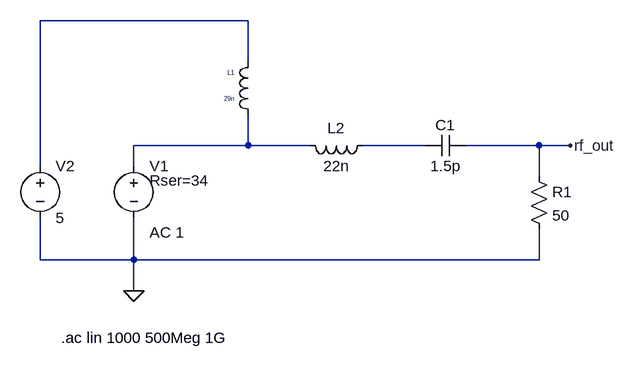
[diagram p0: schematic max41462_matching.asc]
max41462_matching.asc, the LTspice schematic file:
Version 4
SHEET 1 880 680
WIRE 64 32 -256 32
WIRE 64 96 64 32
WIRE 64 224 64 176
WIRE 64 224 -112 224
WIRE 160 224 64 224
WIRE 336 224 240 224
WIRE 512 224 400 224
WIRE 560 224 512 224
WIRE -256 256 -256 32
WIRE -112 256 -112 224
WIRE 512 272 512 224
WIRE -256 400 -256 336
WIRE -112 400 -112 336
WIRE -112 400 -256 400
WIRE 512 400 512 352
WIRE 512 400 -112 400
WIRE -112 448 -112 400
FLAG -112 448 0
FLAG 560 224 rf_out
SYMBOL voltage -112 240 R0
WINDOW 123 24 118 Left 2
WINDOW 39 24 38 Left 2
SYMATTR Value2 AC 1
SYMATTR SpiceLine Rser=34
SYMATTR InstName V1
SYMATTR Value ""
SYMBOL voltage -256 240 R0
SYMATTR InstName V2
SYMATTR Value 5
SYMBOL ind 256 208 R90
WINDOW 0 5 56 VBottom 2
WINDOW 3 32 56 VTop 2
SYMATTR InstName L2
SYMATTR Value 22n
SYMBOL ind 80 192 R180
WINDOW 0 36 80 Left 0
WINDOW 3 36 40 Left 0
SYMATTR InstName L1
SYMATTR Value 29n
SYMBOL res 496 256 R0
SYMATTR InstName R1
SYMATTR Value 50
SYMBOL cap 400 208 R90
WINDOW 0 0 32 VBottom 2
WINDOW 3 32 32 VTop 2
SYMATTR InstName C1
SYMATTR Value 1.5p
TEXT -224 520 Left 2 !.ac lin 1000 500Meg 1G

The netlist it stands for:
* max41462_matching.asc
V1 N002 0 AC 1 Rser=34
V2 N001 0 5
L2 N003 N002 22n
L1 N002 N001 29n
R1 rf_out 0 50
C1 rf_out N003 1.5p
.ac lin 1000 500Meg 1G
.backanno
.end